# Altium schematic sheet REV1.SchDoc
size A4; SheetNumber: 2; SheetTotal: 3
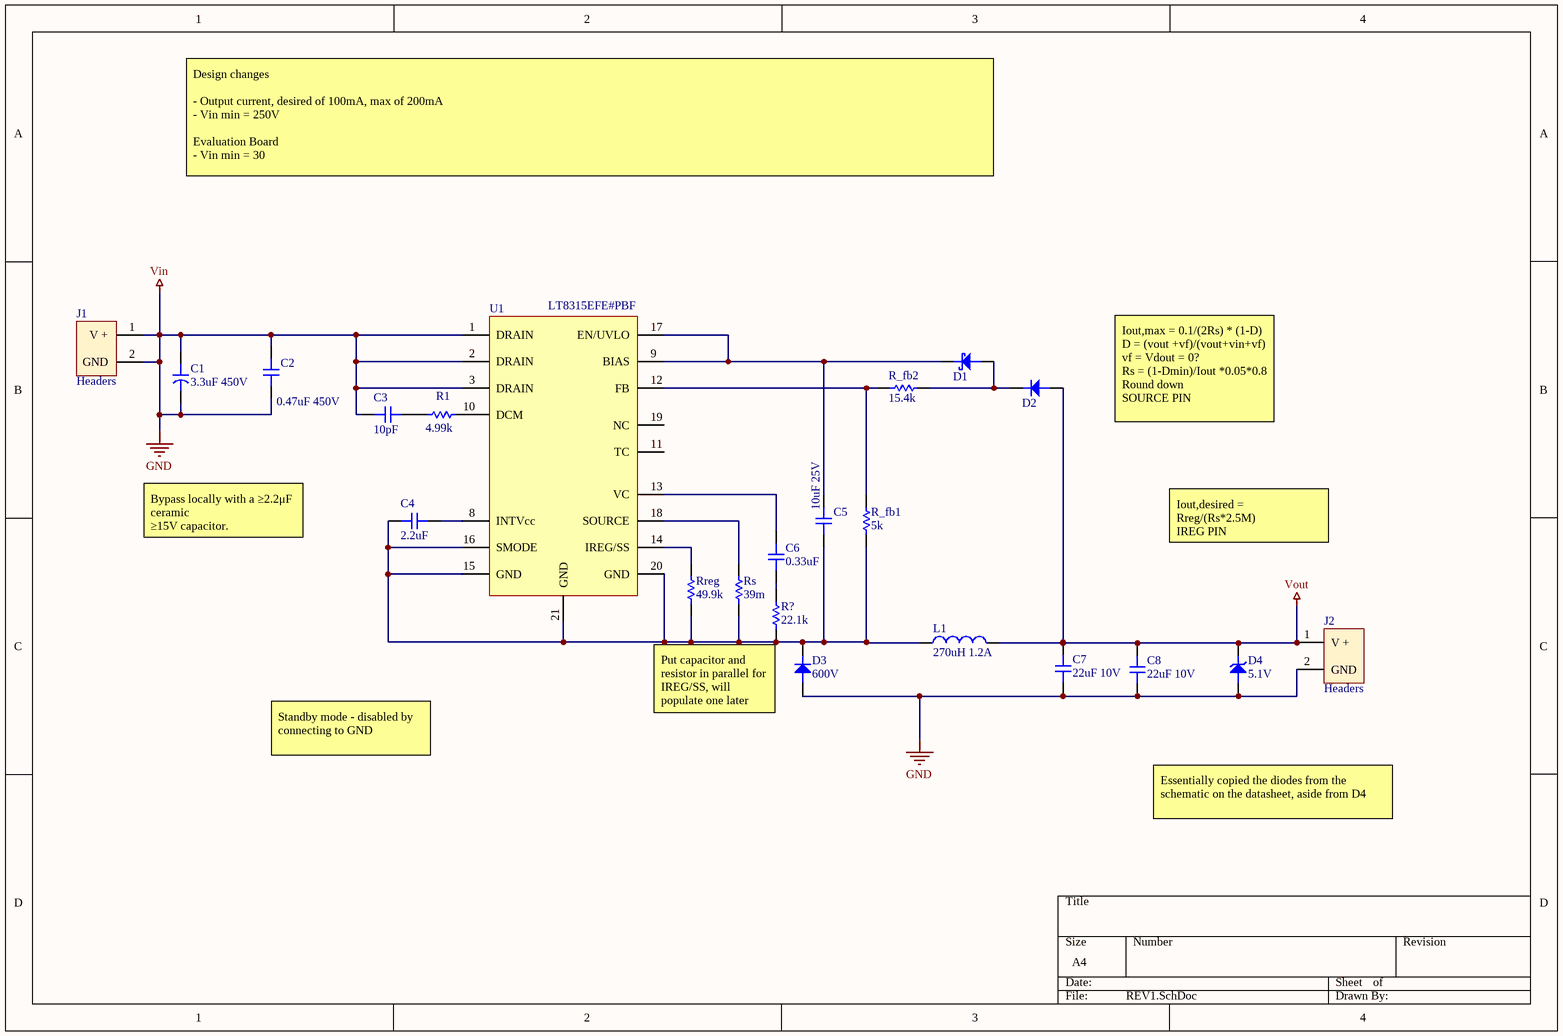
[diagram p0: REV1.SchDoc]

## Parts
C1  3.3uF 450V  [CAPAE125136X145M]
C2  0.47uF 450V  [CAPC4532X28N]
C3  10pF  [CAPC3216X09N]
C4  2.2uF  [CAPC1608X06N]
C5  10uF 25V  [CAPC3216X18N]
C6  0.33uF  [CAPC1608X09N]
C7  22uF 10V  [CAPC3225X28N]
C8  22uF 10V  [CAPC3225X28N]
D1  CMDSH2-3 TR PBFREE  (value not drawn)
D2  CMMR1U-06TRPBFREE  (value not drawn)
D3  600V
D4  5.1V  [SOT95P230X110-3N]
J1  Headers
J2  Headers
L1  270uH 1.2A
R1  4.99k  [4.99K]
R?  22.1k  [RESC2012X06N]
R_fb1  5k  [RESC0603X03N]
R_fb2  15.4k  [RESC1005X04N]
Rreg  49.9k  [RESC3115X07N]
Rs  39m
U1  LT8315EFE#PBF  [TSOP65P650X120-20N]

## Nets
GND: C1.1 C1.2 C2.1 C2.2 C3.1 C7.1 C8.1 D3.2 D4.2 J1.1(V_+) J1.2(GND) J2.2(GND) U1.1(DRAIN) U1.2(DRAIN) U1.3(DRAIN)  [also labelled Vin]
Vout: C7.2 C8.2 D2.2 D4.1 J2.1(V_+) L1.2
NetC3_2: C3.2 R1.1
NetC4_1: C4.1 C5.1 D3.1 L1.1 R?.1 R_fb1.1 Rreg.1 Rs.1 U1.15(GND) U1.16(SMODE) U1.20(GND) U1.21(GND)
NetC4_2: C4.2 U1.8(INTVcc)
NetC5_2: C5.2 D1.1 U1.9(BIAS) U1.17(EN/UVLO)
NetC6_1: C6.1 R?.2
NetC6_2: C6.2 U1.13(VC)
NetD1_2: D1.2 D2.1 R_fb2.2
NetR_fb1_2: R_fb1.2 R_fb2.1 U1.12(FB)
NetRreg_2: Rreg.2 U1.14(IREG/SS)
NetRs_2: Rs.2 U1.18(SOURCE)

Not connected (* = marked no-connect by the designer): R1 2; U1 10(DCM) 11(TC) 19(NC)

## Notes on the sheet
- Design changes
  - Output current, desired of 100mA, max of 200mA
  - Vin min = 250V
  Evaluation Board
  - Vin min = 30
- Iout,max = 0.1/(2Rs) * (1-D)
  D = (vout +vf)/(vout+vin+vf)
  vf = Vdout = 0?
  Rs = (1-Dmin)/Iout *0.05*0.8
  Round down
  SOURCE PIN
- Bypass locally with a ≥2.2μF ceramic
  ≥15V capacitor.
- Iout,desired = Rreg/(Rs*2.5M)
  IREG PIN
- Put capacitor and resistor in parallel for IREG/SS, will populate one later
- Standby mode - disabled by connecting to GND
- Essentially copied the diodes from the schematic on the datasheet, aside from D4

## Library data of the parts
C1 = UUJ2W3R3MNQ1MS: Al Cap UJ series SMT 3.3uF 450V; Manufacturer: Nichicon; Tolerance: 20%; Ripple Current: 40mA; Polarity: Polar; Leakage Current: 100uA; Life (Hours): 5000Hour; Lead Diameter: 1.4mm; Supplier 1: Digi-Key; Manufacturer Part Number: UUJ2W3R3MNQ1MS; RoHS: Yes; Category: Aluminum Electrolytic Capacitors; Stock 1: 1639; Pricing 1: 1=1.50000, 10=1.18700, 50=1.02860, 100=0.89010 (USD); Mount: Surface Mount; Case/Package: Radial; Min Operating Temperature: -40°C; Max Operating Temperature: 105°C; Capacitance: 3.3uF; Voltage Rating (DC): 450V; Packaging: Tape and Reel; Package Quantity: 500; Voltage Rating: 450V; Termination: SMD/SMT; Voltage: 450V; Series: UJ; Construction: Cylindrical; Diameter: 12.5mm; Length: 13.5mm; Height: 13.5mm; Lead Pitch: 4mm; Height - Seated (Max): 0.571inch; Radiation Hardening: No; RoHS Compliant: Yes; ComponentLink1URL: https://datasheet.ciiva.com/11781/0900766b80fa39e6-11781932.pdf?src-supplier=RSComponents; ComponentLink1Description: https://datasheet.ciiva.com/11781/0900766b80fa39e6-11781932.pdf?src-supplier=RSComponents; ComponentLink2URL: https://datasheet.ciiva.com/11687/e-uj-11687990.pdf?src-supplier=Avnet; ComponentLink2Description: https://datasheet.ciiva.com/11687/e-uj-11687990.pdf?src-supplier=Avnet; Supplier Part Number 1: 493-16089-1-ND
C2 = CGA8N4X7T2W474M230KA: Automotive Grade MLCC, 1812, X7T, 450V, 0.47 F, 20%, 2.30mm; Manufacturer: TDK; Capacitance: 470nF; Supplier 1: Digi-Key; Manufacturer Part Number: CGA8N4X7T2W474M230KA; RoHS: Yes; Category: Ceramic Capacitors; Stock 1: 1741; Pricing 1: 1=1.20000, 10=0.94400, 50=0.81800, 100=0.70780 (USD); Mount: Surface Mount; Case/Package: 1812; Case Code (Metric): 4532; Case Code (Imperial): 1812; Min Operating Temperature: -55°C; Max Operating Temperature: 125°C; Package Quantity: 500; Packaging: Tape and Reel; Tolerance: 20%; Voltage Rating: 450V; Series: CGA; Length: 0.177inch; Width: 0.126inch; Thickness: 0.098inch; Ratings: AEC-Q200; ComponentLink1URL: https://product.tdk.com/info/en/documents/chara_sheet/CGA8N4X7T2W474M230KA.pdf?src-supplier=Digi-Key; ComponentLink1Description: https://product.tdk.com/info/en/documents/chara_sheet/CGA8N4X7T2W474M230KA.pdf?src-supplier=Digi-Key; ComponentLink2URL: https://product.tdk.com/info/en/catalog/spec/mlccspec_automotive_general_midvoltage_en.pdf?src-supplier=Digi-Key; ComponentLink2Description: https://product.tdk.com/info/en/catalog/spec/mlccspec_automotive_general_midvoltage_en.pdf?src-supplier=Digi-Key; ComponentLink3URL: http://product.tdk.com/en/catalog/datasheets/mlcc_automotive_midvoltage_en.pdf?src-supplier=Avnet; ComponentLink3Description: http://product.tdk.com/en/catalog/datasheets/mlcc_automotive_midvoltage_en.pdf?src-supplier=Avnet; Supplier Part Number 1: 445-13132-1-ND
C3 = 885012008019: CAP CER 10PF 25V C0G/NP0 1206; Manufacturer: Wurth Electronics; Tolerance: 5%; Supplier 1: Digi-Key; Manufacturer Part Number: 885012008019; RoHS: Yes; Category: Ceramic Capacitors; Stock 1: 6290; Pricing 1: 1=0.11000, 10=0.09700, 100=0.08690, 500=0.07690 (USD); Mount: Surface Mount; Case/Package: 1206; Case Code (Metric): 3216; Case Code (Imperial): 1206; Min Operating Temperature: -55°C; Max Operating Temperature: 125°C; Packaging: Tape and Reel; Capacitance: 10pF; Voltage Rating: 25V; Length: 0.126inch; Width: 0.063inch; Thickness: 0.035inch; RoHS Compliant: Yes; ComponentLink1URL: http://www.farnell.com/datasheets/2546682.pdf?src-supplier=Farnell; ComponentLink1Description: http://www.farnell.com/datasheets/2546682.pdf?src-supplier=Farnell; ComponentLink2URL: http://katalog.we-online.de/pbs/datasheet/885012008019.pdf?src-supplier=Digi-Key; ComponentLink2Description: http://katalog.we-online.de/pbs/datasheet/885012008019.pdf?src-supplier=Digi-Key; ComponentLink3URL: https://katalog.we-online.de/pbs/datasheet/885012008019.pdf?src-supplier=Digi-Key; ComponentLink3Description: https://katalog.we-online.de/pbs/datasheet/885012008019.pdf?src-supplier=Digi-Key; Supplier Part Number 1: 732-7872-1-ND
C4 = EMK107BBJ225MK-T: CAP CER 2.2UF 16V X5R 0603; Manufacturer: Taiyo Yuden; Tolerance: 20%; Supplier 1: Digi-Key; Manufacturer Part Number: EMK107BBJ225MK-T; RoHS: Yes; Category: Ceramic Capacitors; Stock 1: 6186; Pricing 1: 1=0.27000, 10=0.18800, 50=0.12560, 100=0.10670, 500=0.07534, 1000=0.06593 (USD); Mount: Surface Mount; Case/Package: 0603; Min Operating Temperature: -55°C; Max Operating Temperature: 85°C; Packaging: Cut Tape; Capacitance: 2.2uF; Voltage Rating: 16V; RoHS Compliant: Yes; ComponentLink1URL: http://ds.yuden.co.jp/TYCOMPAS/ut/detail.do?productNo=EMK107BBJ225MK-T&fileName=EMK107BBJ225MK-T_SS&mode=specSheetDownload&src-supplier=Digi-Key; ComponentLink1Description: http://ds.yuden.co.jp/TYCOMPAS/ut/detail.do?productNo=EMK107BBJ225MK-T&fileName=EMK107BBJ225MK-T_SS&mode=specSheetDownload&src-supplier=Digi-Key; Supplier Part Number 1: 587-4866-1-ND
C5 = C3216X5R1E106M085AC: CAP CER 10UF 25V X5R 1206; Manufacturer: TDK; Dielectric Material: Ceramic; Tolerance: 20%; Supplier 1: Digi-Key; Manufacturer Part Number: C3216X5R1E106M085AC; RoHS: Yes; Category: Ceramic Capacitors; Stock 1: 61121; Pricing 1: 1=0.57000, 10=0.40100, 50=0.30300, 100=0.26390, 500=0.19550, 1000=0.16618 (USD); Mount: Surface Mount; Case/Package: 1206; Case Code (Metric): 3216; Case Code (Imperial): 1206; Weight: 0.000571oz; Min Operating Temperature: -55°C; Max Operating Temperature: 85°C; Package Quantity: 4000; Packaging: Tape and Reel; Capacitance: 10uF; Voltage Rating: 25V; Dielectric: X5R; Termination: SMD/SMT; Voltage Rating (DC): 25V; Series: C; Length: 0.126inch; Width: 0.063inch; Height: 0.85mm; Thickness: 0.039inch; Lead Free: Lead Free; ComponentLink1URL: https://datasheet.ciiva.com/14908/tdkmlcccaprange-14908421.pdf?src-supplier=Digi-Key; ComponentLink1Description: https://datasheet.ciiva.com/14908/tdkmlcccaprange-14908421.pdf?src-supplier=Digi-Key; ComponentLink2URL: https://datasheet.ciiva.com/14908/tdkmlcccaprange-14908422.pdf?src-supplier=Digi-Key; ComponentLink2Description: https://datasheet.ciiva.com/14908/tdkmlcccaprange-14908422.pdf?src-supplier=Digi-Key; Supplier Part Number 1: 445-14678-1-ND
C6 = 885012206023: CAP CER 0.33UF 10V X7R 0603; Manufacturer: Wurth Electronics; Capacitance: 330nF; Tolerance: 10%; Supplier 1: Digi-Key; Manufacturer Part Number: 885012206023; RoHS: Yes; Category: Ceramic Capacitors; Stock 1: 791; Pricing 1: 1=0.10000, 10=0.07800, 100=0.07020, 500=0.06210 (USD); Mount: Surface Mount; Case/Package: 0603; Case Code (Metric): 1608; Case Code (Imperial): 0603; Min Operating Temperature: -55°C; Max Operating Temperature: 125°C; Packaging: Cut Tape; Voltage Rating: 10V; Length: 0.063inch; Width: 0.031inch; Thickness: 0.037inch; RoHS Compliant: Yes; ComponentLink1URL: http://www.farnell.com/datasheets/2546810.pdf?src-supplier=Farnell; ComponentLink1Description: http://www.farnell.com/datasheets/2546810.pdf?src-supplier=Farnell; ComponentLink2URL: https://katalog.we-online.de/pbs/datasheet/885012206023.pdf?src-supplier=Digi-Key; ComponentLink2Description: https://katalog.we-online.de/pbs/datasheet/885012206023.pdf?src-supplier=Digi-Key; Supplier Part Number 1: 732-7942-1-ND
C7 C8 = C3225X5R1A226M230AA: CAP CER 22UF 10V X5R 1210; Manufacturer: TDK; Dielectric Material: Ceramic; Tolerance: 20%; Supplier 1: Digi-Key; Manufacturer Part Number: C3225X5R1A226M230AA; RoHS: Yes; Category: Ceramic Capacitors; Stock 1: 29265; Pricing 1: 1=0.59000, 10=0.41500, 50=0.31380, 100=0.27320, 500=0.20240 (USD); Mount: Surface Mount; Case/Package: 1210; Number of Pins: 2; Case Code (Metric): 3225; Case Code (Imperial): 1210; Weight: 0.000564oz; Min Operating Temperature: -55°C; Max Operating Temperature: 85°C; Capacitance: 22uF; Voltage Rating: 10V; Packaging: Tape and Reel; Package Quantity: 1; Voltage Rating (DC): 10V; Dielectric: X5R; Termination: SMD/SMT; Voltage: 10V; Series: C; Construction: Flat; Resistor Type: Ceramic; Length: 3.2mm; Width: 0.098inch; Height: 2.3mm; Depth: 2.5mm; Thickness: 0.098inch; REACH SVHC: No SVHC; Lead Free: Lead Free; ComponentLink1URL: https://datasheet.ciiva.com/11785/0900766b80c1bb00-11785903.pdf?src-supplier=RSComponents; ComponentLink1Description: https://datasheet.ciiva.com/11785/0900766b80c1bb00-11785903.pdf?src-supplier=RSComponents; ComponentLink2URL: https://datasheet.ciiva.com/6252/tdkmlcccaprange-6252831.pdf?src-supplier=Digi-Key; ComponentLink2Description: https://datasheet.ciiva.com/6252/tdkmlcccaprange-6252831.pdf?src-supplier=Digi-Key; ComponentLink3URL: https://datasheet.ciiva.com/6252/tdkmlcccaprange-6252837.pdf?src-supplier=Digi-Key; ComponentLink3Description: https://datasheet.ciiva.com/6252/tdkmlcccaprange-6252837.pdf?src-supplier=Digi-Key; ComponentLink4URL: https://datasheet.ciiva.com/16498/e412-c-16498766.pdf?src-supplier=Future+Electronics; ComponentLink4Description: https://datasheet.ciiva.com/16498/e412-c-16498766.pdf?src-supplier=Future+Electronics; ComponentLink5URL: https://datasheet.ciiva.com/28620/1571323-28620619.pdf?src-supplier=Element14; ComponentLink5Description: https://datasheet.ciiva.com/28620/1571323-28620619.pdf?src-supplier=Element14; ComponentLink6URL: https://datasheet.ciiva.com/22694/639999-22694174.pdf?src-supplier=Element14; ComponentLink6Description: https://datasheet.ciiva.com/22694/639999-22694174.pdf?src-supplier=Element14; Supplier Part Number 1: 445-1403-1-ND
D1 = CMDSH2-3 TR PBFREE: Silicon SCHOTTKY Diode High Current 30V 1A 2-Pin SOD-323 Surface Mount T/R; Manufacturer: Central Semiconductor; Supplier 1: Digi-Key; Manufacturer Part Number: CMDSH2-3 TR PBFREE; RoHS: Yes; Stock 1: 40881; Pricing 1: 1=0.65000, 10=0.57200, 100=0.43830, 500=0.34650, 1000=0.27720 (USD); RoHS Compliant: Yes; Supplier Part Number 1: 1514-CMDSH2-3TRPBFREECT-ND
D2 = CMMR1U-06TRPBFREE: Diode Switching 600V 1A Automotive 2-Pin SOD-123F T/R; Manufacturer: Central Semiconductor; Forward Voltage: 1.7V; Peak Non-Repetitive Surge Current: 30A; Element Configuration: Single; Supplier 1: Digi-Key; Manufacturer Part Number: CMMR1U-06TRPBFREE; RoHS: Yes; Category: Uncategorized; Stock 1: 10653; Pricing 1: 1=0.82000, 10=0.72600, 100=0.55660, 500=0.44000, 1000=0.35200 (USD); Mount: Surface Mount; Case/Package: SOD; Number of Pins: 2; Min Operating Temperature: -65°C; Max Operating Temperature: 150°C; Packaging: Tape and Reel; Radiation Hardening: No; RoHS Compliant: Yes; ComponentLink1URL: https://datasheet.ciiva.com/26939/getdatasheetpartid-707878-26939601.pdf?src-supplier=Verical; ComponentLink1Description: https://datasheet.ciiva.com/26939/getdatasheetpartid-707878-26939601.pdf?src-supplier=Verical; Supplier Part Number 1: 1514-CMMR1U-06TRPBFREECT-ND
D3 = HS2JFSM3G: https://www.mouser.ca/datasheet/2/395/HS2DFS_SERIES_B2004-1918239.pdf; Manufacturer: Taiwan Semiconductor; Supplier 1: DigiKey; Manufacturer Part Number: HS2JFSM3G; RoHS: No; Stock 1: 3460; Pricing 1: 1=0.45000, 10=0.38700, 100=0.28900, 500=0.22704, 1000=0.17544 (USD); Supplier Part Number 1: 1801-HS2JFSM3GCT-ND
D4 = BZX84-C5V1,215: Zener Diode Single 5.1V 5% 60Ohm 250mW Automotive 3-Pin SOT-23 T/R; Manufacturer: Nexperia; Supplier 1: Digi-Key; Manufacturer Part Number: BZX84-C5V1,215; RoHS: Yes; Stock 1: 23070; Pricing 1: 1=0.14000, 10=0.12900, 100=0.07000, 500=0.04308, 1000=0.02937 (USD); RoHS Compliant: Yes; ComponentLink1URL: http://www.farnell.com/datasheets/2242065.pdf?src-supplier=Farnell; ComponentLink1Description: http://www.farnell.com/datasheets/2242065.pdf?src-supplier=Farnell; ComponentLink2URL: https://assets.nexperia.com/documents/data-sheet/BZX84_SER.pdf?src-supplier=Digi-Key; ComponentLink2Description: https://assets.nexperia.com/documents/data-sheet/BZX84_SER.pdf?src-supplier=Digi-Key; Supplier Part Number 1: 1727-2939-1-ND
L1 = SDR1307-271KL: FIXED IND 270UH 1.2A 410 MOHM; Manufacturer: Bourns; Core Material: Ferrite; Saturation Current: 1.8A; Tolerance: 10%; Shielding: Unshielded; Self Resonant Frequency: 3.5MHz; Q Factor: 15; DC Resistance (DCR): 410mR; Test Frequency: 100kHz; Supplier 1: Digi-Key; Manufacturer Part Number: SDR1307-271KL; RoHS: Yes; Category: Fixed Inductors; Stock 1: 932; Pricing 1: 1=1.10000, 10=1.02200, 25=0.94400, 50=0.78640, 100=0.73930 (USD); Mount: Surface Mount; Case/Package: Nonstandard; Min Operating Temperature: -40°C; Max Operating Temperature: 125°C; Package Quantity: 400; Current Rating: 1.2A; Packaging: Tape and Reel; Inductance Tolerance: 10%; Inductance: 270uH; Resistor Type: Wirewound; Max DC Current: 1.2A; Termination: SMD/SMT; DC Current: 1.2A; RMS Current (Irms): 1.2A; Series: SDR1307; Diameter: 13mm; Length: 0.512inch; Width: 0.512inch; Height: 0.276inch; Height - Seated (Max): 0.288inch; Radiation Hardening: No; REACH SVHC: No SVHC; Military Standard: Not; ComponentLink1URL: https://datasheet.ciiva.com/1060/sdr1307-1060134.pdf?src-supplier=Digi-Key; ComponentLink1Description: https://datasheet.ciiva.com/1060/sdr1307-1060134.pdf?src-supplier=Digi-Key; ComponentLink2URL: https://datasheet.ciiva.com/1060/sdr1307-1060135.pdf?src-supplier=Digi-Key; ComponentLink2Description: https://datasheet.ciiva.com/1060/sdr1307-1060135.pdf?src-supplier=Digi-Key; ComponentLink3URL: https://datasheet.ciiva.com/8515/sdr1307-8515135.pdf?src-supplier=Avnet; ComponentLink3Description: https://datasheet.ciiva.com/8515/sdr1307-8515135.pdf?src-supplier=Avnet; ComponentLink4URL: https://datasheet.ciiva.com/6708/sdr1307-6708549.pdf?src-supplier=Digi-Key; ComponentLink4Description: https://datasheet.ciiva.com/6708/sdr1307-6708549.pdf?src-supplier=Digi-Key; ComponentLink5URL: https://datasheet.ciiva.com/22715/1723200-22715551.pdf?src-supplier=Element14; ComponentLink5Description: https://datasheet.ciiva.com/22715/1723200-22715551.pdf?src-supplier=Element14; ComponentLink6URL: https://datasheet.ciiva.com/30244/sdr1307-30244511.pdf?src-supplier=Onlinecomponents.com; ComponentLink6Description: https://datasheet.ciiva.com/30244/sdr1307-30244511.pdf?src-supplier=Onlinecomponents.com; Supplier Part Number 1: SDR1307-271KLCT-ND
R1 = CRCW12064K99FKEA: 4.99K DCM; Manufacturer: Vishay; Resistance: 4.99kR; Tolerance: 1%; Power Rating: 250mW; Temperature Coefficient: 100ppm/°C; Voltage Rating: 200V; Supplier 1: Digi-Key; Manufacturer Part Number: CRCW12064K99FKEA; RoHS: Yes; Category: Chip SMD Resistors; Stock 1: 47425; Pricing 1: 1=0.10000, 10=0.08200, 100=0.03160, 1000=0.01392, 2500=0.01202 (USD); Mount: Surface Mount; Case/Package: 1206; Contact Plating: Tin; Weight: 0.000353oz; Case Code (Metric): 3216; Case Code (Imperial): 1206; Size Code: 1206; Min Operating Temperature: -55°C; Max Operating Temperature: 155°C; Resistor Type: Thick Film; Packaging: Tape and Reel; Package Quantity: 10; Number of Terminations: 2; Termination: Solder; Max Power Dissipation: 250mW; Features: Automotive AEC-Q200; Series: CRCW; Voltage Rating (DC): 200V; Resistance Tolerance: 1%; Construction: Rectangular; Technology: THICK FILM; Length: 3.2mm; Width: 0.063inch; Height: 0.55mm; Depth: 1.6mm; Radiation Hardening: No; Lead Free: Lead Free; RoHS Compliant: Yes; REACH SVHC: Unknown; Military Standard: Not; ComponentLink1URL: https://datasheet.ciiva.com/2468/dcrcwe3-2468919.pdf?src-supplier=Digi-Key; ComponentLink1Description: https://datasheet.ciiva.com/2468/dcrcwe3-2468919.pdf?src-supplier=Digi-Key; ComponentLink2URL: https://datasheet.ciiva.com/2468/dcrcwe3-2468920.pdf?src-supplier=Digi-Key; ComponentLink2Description: https://datasheet.ciiva.com/2468/dcrcwe3-2468920.pdf?src-supplier=Digi-Key; ComponentLink3URL: https://datasheet.ciiva.com/2468/dcrcwe3-2468921.pdf?src-supplier=Digi-Key; ComponentLink3Description: https://datasheet.ciiva.com/2468/dcrcwe3-2468921.pdf?src-supplier=Digi-Key; ComponentLink4URL: https://datasheet.ciiva.com/5551/dcrcwe3-109170-5551479.pdf?src-supplier=Mouser; ComponentLink4Description: https://datasheet.ciiva.com/5551/dcrcwe3-109170-5551479.pdf?src-supplier=Mouser; ComponentLink5URL: https://datasheet.ciiva.com/9069/dcrcwe3-9069199.pdf?src-supplier=Avnet; ComponentLink5Description: https://datasheet.ciiva.com/9069/dcrcwe3-9069199.pdf?src-supplier=Avnet; ComponentLink6URL: https://datasheet.ciiva.com/16380/dcrcwe3-16380955.pdf?src-supplier=Future+Electronics; ComponentLink6Description: https://datasheet.ciiva.com/16380/dcrcwe3-16380955.pdf?src-supplier=Future+Electronics; ComponentLink7URL: https://datasheet.ciiva.com/16755/70201119-16755772.pdf?src-supplier=Allied+Electronics; ComponentLink7Description: https://datasheet.ciiva.com/16755/70201119-16755772.pdf?src-supplier=Allied+Electronics; ComponentLink8URL: https://datasheet.ciiva.com/16514/dcrcwe3-16514539.pdf?src-supplier=Avnet+Asia; ComponentLink8Description: https://datasheet.ciiva.com/16514/dcrcwe3-16514539.pdf?src-supplier=Avnet+Asia; Supplier Part Number 1: 541-4.99KFCT-ND
R? = RMCF0805FG22K1: Res Thick Film 0805 22.1K Ohm 1% 1/8W 100ppm/C Molded SMD SMD Paper T/R; Manufacturer: Stackpole Electronics; Resistance: 22.1kR; Max Power Dissipation: 125mW; Temperature Coefficient: 100ppm/°C; Supplier 1: Digi-Key; Manufacturer Part Number: RMCF0805FG22K1; RoHS: Yes; Category: Chip SMD Resistors; Stock 1: 16110; Pricing 1: 1=0.10000, 10=0.02700, 100=0.01090, 1000=0.00488, 2500=0.00423, 5000=0.00350 (USD); Mount: Surface Mount; Case/Package: 0805; Case Code (Metric): 2012; Case Code (Imperial): 0805; Contact Plating: Tin,Matte; Min Operating Temperature: -55°C; Max Operating Temperature: 155°C; Package Quantity: 10000; Packaging: Tape and Reel; Tolerance: 1%; Resistor Type: Thick Film; Number of Terminations: 2; Features: Automotive AEC-Q200; Series: RMCF; Length: 0.079inch; Width: 0.049inch; Height: 0.026inch; Radiation Hardening: No; Lead Free: Lead Free; RoHS Compliant: Yes; ComponentLink1URL: https://www.seielect.com/catalog/SEI-RMCF_RMCP.pdf?src-supplier=Avnet; ComponentLink1Description: https://www.seielect.com/catalog/SEI-RMCF_RMCP.pdf?src-supplier=Avnet; ComponentLink2URL: http://www.seielect.com/Catalog/SEI-RMCF_RMCP.pdf?src-supplier=Digi-Key; ComponentLink2Description: http://www.seielect.com/Catalog/SEI-RMCF_RMCP.pdf?src-supplier=Digi-Key; ComponentLink3URL: https://www.seielect.com/catalog/SEI-Packaging.pdf?src-supplier=Digi-Key; ComponentLink3Description: https://www.seielect.com/catalog/SEI-Packaging.pdf?src-supplier=Digi-Key; ComponentLink4URL: https://www.seielect.com/Catalog/SEI-RMCF_RMCP.pdf?src-supplier=Digi-Key; ComponentLink4Description: https://www.seielect.com/Catalog/SEI-RMCF_RMCP.pdf?src-supplier=Digi-Key; Supplier Part Number 1: RMCF0805FG22K1CT-ND
R_fb1 = TNPW02015K00BEED: Manufacturer: Vishay Dale; Supplier 1: Digi-Key; Manufacturer Part Number: TNPW02015K00BEED; RoHS: No; Stock 1: 3323; Pricing 1: 1=0.48000, 10=0.36500, 100=0.15350, 1000=0.08467, 2500=0.07938, 5000=0.07144 (USD); Supplier Part Number 1: 541-TNPW02015K00BEEDCT-ND
R_fb2 = ERJ-2RKF1542X: GLOVE, POLYAMIDE, L/FREE, PU, SIZE 6 - More Details; Manufacturer: Panasonic; Resistance: 15.4kR; Tolerance: 1%; Power Rating: 100mW; Voltage Rating: 50V; Temperature Coefficient: 100ppm/°C; Supplier 1: Digi-Key; Manufacturer Part Number: ERJ-2RKF1542X; RoHS: Yes; Category: Chip SMD Resistors; Stock 1: 11260; Pricing 1: 1=0.10000, 10=0.02500, 100=0.01020, 1000=0.00457, 2500=0.00397, 5000=0.00328 (USD); Mount: Surface Mount; Case/Package: 0402; Case Code (Imperial): 0402; Case Code (Metric): 1005; Contact Plating: Tin; Weight: 2.8E-05oz; Min Operating Temperature: -55°C; Max Operating Temperature: 155°C; Packaging: Tape and Reel; Package Quantity: 1; Resistor Type: Thick Film; Termination: SMD/SMT; Number of Terminations: 2; Max Power Dissipation: 100mW; Voltage Rating (DC): 50V; Features: Automotive AEC-Q200; Series: ERJ; Resistance Tolerance: 1%; Technology: THICK FILM; Construction: Rectangular; Length: 1mm; Width: 0.5mm; Height: 0.35mm; Depth: 0.5mm; Radiation Hardening: No; REACH SVHC: Yes; Military Standard: Not; RoHS Compliant: Yes; Lead Free: Lead Free; ComponentLink1URL: https://datasheet.ciiva.com/22774/1678782-22774075.pdf?src-supplier=Farnell; ComponentLink1Description: https://datasheet.ciiva.com/22774/1678782-22774075.pdf?src-supplier=Farnell; ComponentLink2URL: https://datasheet.ciiva.com/24163/aoa0000ce2-24163722.pdf?src-supplier=Mouser; ComponentLink2Description: https://datasheet.ciiva.com/24163/aoa0000ce2-24163722.pdf?src-supplier=Mouser; ComponentLink3URL: https://datasheet.ciiva.com/30091/aoa0000ce2-30091305.pdf?src-supplier=Onlinecomponents.com; ComponentLink3Description: https://datasheet.ciiva.com/30091/aoa0000ce2-30091305.pdf?src-supplier=Onlinecomponents.com; ComponentLink4URL: https://datasheet.ciiva.com/46436/1678782-46436982.pdf?src-supplier=Element14; ComponentLink4Description: https://datasheet.ciiva.com/46436/1678782-46436982.pdf?src-supplier=Element14; ComponentLink5URL: https://datasheet.ciiva.com/16760/70260748-16760316.pdf?src-supplier=Allied+Electronics; ComponentLink5Description: https://datasheet.ciiva.com/16760/70260748-16760316.pdf?src-supplier=Allied+Electronics; ComponentLink6URL: https://datasheet.ciiva.com/16761/70260748-16761511.pdf?src-supplier=Allied+Electronics; ComponentLink6Description: https://datasheet.ciiva.com/16761/70260748-16761511.pdf?src-supplier=Allied+Electronics; ComponentLink7URL: https://datasheet.ciiva.com/22681/1678782-22681271.pdf?src-supplier=Element14; ComponentLink7Description: https://datasheet.ciiva.com/22681/1678782-22681271.pdf?src-supplier=Element14; Supplier Part Number 1: P15.4KLCT-ND
Rreg = ERJ-8ENF4992V: RES SMD 49.9K OHM 1% 1/4W 1206; Manufacturer: Panasonic; Resistance: 49.9kR; Temperature Coefficient: 100ppm/°C; Voltage Rating: 200V; Power Rating: 250mW; Supplier 1: Digi-Key; Manufacturer Part Number: ERJ-8ENF4992V; RoHS: Yes; Category: Chip SMD Resistors; Stock 1: 75366; Pricing 1: 1=0.10000, 10=0.09300, 100=0.03560, 1000=0.01569, 2500=0.01355 (USD); Mount: Surface Mount; Case/Package: 1206; Contact Plating: Tin; Case Code (Metric): 3216; Case Code (Imperial): 1206; Min Operating Temperature: -55°C; Max Operating Temperature: 155°C; Tolerance: 1%; Resistor Type: Thick Film; Packaging: Tape and Reel; Package Quantity: 1; Number of Terminations: 2; Termination: SMD/SMT; Max Power Dissipation: 250mW; Voltage Rating (DC): 200V; Series: ERJ; Construction: Rectangular; Resistance Tolerance: 1%; Features: Automotive AEC-Q200; Length: 3.2mm; Width: 0.063inch; Height: 0.028inch; Depth: 1.6mm; Radiation Hardening: No; REACH SVHC: Unknown; Military Standard: Not; RoHS Compliant: Yes; Lead Free: Contains Lead; ComponentLink1URL: https://datasheet.ciiva.com/6064/426256-6064697.pdf?src-supplier=Farnell; ComponentLink1Description: https://datasheet.ciiva.com/6064/426256-6064697.pdf?src-supplier=Farnell; ComponentLink2URL: https://datasheet.ciiva.com/46377/426256-46377947.pdf?src-supplier=Element14; ComponentLink2Description: https://datasheet.ciiva.com/46377/426256-46377947.pdf?src-supplier=Element14; ComponentLink3URL: https://datasheet.ciiva.com/28548/1678782-28548377.pdf?src-supplier=Element14; ComponentLink3Description: https://datasheet.ciiva.com/28548/1678782-28548377.pdf?src-supplier=Element14; ComponentLink4URL: https://datasheet.ciiva.com/28694/1678782-28694249.pdf?src-supplier=Element14; ComponentLink4Description: https://datasheet.ciiva.com/28694/1678782-28694249.pdf?src-supplier=Element14; ComponentLink5URL: https://datasheet.ciiva.com/24026/aoa0000ce2-24026814.pdf?src-supplier=Mouser; ComponentLink5Description: https://datasheet.ciiva.com/24026/aoa0000ce2-24026814.pdf?src-supplier=Mouser; ComponentLink6URL: https://datasheet.ciiva.com/16772/70260748-16772229.pdf?src-supplier=Allied+Electronics; ComponentLink6Description: https://datasheet.ciiva.com/16772/70260748-16772229.pdf?src-supplier=Allied+Electronics; ComponentLink7URL: https://datasheet.ciiva.com/16724/70260748-16724652.pdf?src-supplier=Allied+Electronics; ComponentLink7Description: https://datasheet.ciiva.com/16724/70260748-16724652.pdf?src-supplier=Allied+Electronics; ComponentLink8URL: https://datasheet.ciiva.com/9189/aoa0000ce2-9189145.pdf?src-supplier=Avnet; ComponentLink8Description: https://datasheet.ciiva.com/9189/aoa0000ce2-9189145.pdf?src-supplier=Avnet; ComponentLink9URL: https://datasheet.ciiva.com/30219/aoa0000ce2-30219902.pdf?src-supplier=Onlinecomponents.com; ComponentLink9Description: https://datasheet.ciiva.com/30219/aoa0000ce2-30219902.pdf?src-supplier=Onlinecomponents.com; ComponentLink10URL: https://datasheet.ciiva.com/17209/aoa0000ce2-17209499.pdf?src-supplier=Avnet+Europe; ComponentLink10Description: https://datasheet.ciiva.com/17209/aoa0000ce2-17209499.pdf?src-supplier=Avnet+Europe; ComponentLink11URL: https://datasheet.ciiva.com/16513/aoa0000ce2-16513653.pdf?src-supplier=Avnet+Asia; ComponentLink11Description: https://datasheet.ciiva.com/16513/aoa0000ce2-16513653.pdf?src-supplier=Avnet+Asia; Supplier Part Number 1: P49.9KFCT-ND
Rs = ERJ-8CWJR039V: Res Thick Film 1206 0.039 Ohm 5% 1W 50ppm/C Molded SMD SMD Punched Carrier T/R; Manufacturer: Panasonic; Resistance: 39mR; Temperature Coefficient: 75ppm/°C; Supplier 1: Digi-Key; Manufacturer Part Number: ERJ-8CWJR039V; RoHS: Yes; Category: Chip SMD Resistors; Stock 1: 4176; Pricing 1: 1=0.54000, 10=0.41700, 100=0.17540, 1000=0.09678, 2500=0.09074 (USD); Mount: Surface Mount; Case/Package: 1206; Case Code (Metric): 3216; Case Code (Imperial): 1206; Min Operating Temperature: -55°C; Max Operating Temperature: 125°C; Packaging: Tape and Reel; Power Rating: 1W; Tolerance: 5%; Resistor Type: Thick Film; Number of Terminations: 2; Max Power Dissipation: 1W; Features: Automotive AEC-Q200; Length: 0.126inch; Width: 0.063inch; Height: 0.03inch; ComponentLink1URL: https://media.digikey.com/pdf/Data%20Sheets/Panasonic%20Resistors%20Thermistors%20PDFs/ERJ-8CW_Series_LE.pdf?src-supplier=Digi-Key; ComponentLink1Description: https://media.digikey.com/pdf/Data%20Sheets/Panasonic%20Resistors%20Thermistors%20PDFs/ERJ-8CW_Series_LE.pdf?src-supplier=Digi-Key; ComponentLink2URL: http://www.mouser.com/ds/2/315/AOA0000C295-1109214.pdf?src-supplier=Mouser; ComponentLink2Description: http://www.mouser.com/ds/2/315/AOA0000C295-1109214.pdf?src-supplier=Mouser; ComponentLink3URL: http://www.onlinecomponents.com/datasheet/erj-8cwjr039v.aspx?p=44454211&src-supplier=Onlinecomponents.com; ComponentLink3Description: http://www.onlinecomponents.com/datasheet/erj-8cwjr039v.aspx?p=44454211&src-supplier=Onlinecomponents.com; ComponentLink4URL: https://industrial.panasonic.com/cdbs/www-data/pdf/RDN0000/AOA0000C313.pdf?src-supplier=Digi-Key; ComponentLink4Description: https://industrial.panasonic.com/cdbs/www-data/pdf/RDN0000/AOA0000C313.pdf?src-supplier=Digi-Key; ComponentLink5URL: http://industrial.panasonic.com/www-data/pdf/AOA0000/AOA0000CE3.pdf?src-supplier=Avnet; ComponentLink5Description: http://industrial.panasonic.com/www-data/pdf/AOA0000/AOA0000CE3.pdf?src-supplier=Avnet; Supplier Part Number 1: P0.039BWCT-ND
U1 = LT8315EFE#PBF: IC REG CTRLR FLYBACK 20TSSOP; Manufacturer: Analog Devices / Linear Technology; Supplier 1: Digi-Key; Manufacturer Part Number: LT8315EFE#PBF; RoHS: Yes; Category: Voltage Regulators - Switching; Stock 1: 22; Pricing 1: 1=9.84000, 10=8.88800, 25=8.47480, 100=7.35850, 250=7.02780, 500=6.43500 (USD); RoHS Compliant: Yes; ComponentLink1URL: http://www.linear.com/docs/56703?src-supplier=Digi-Key; ComponentLink1Description: http://www.linear.com/docs/56703?src-supplier=Digi-Key; Supplier Part Number 1: LT8315EFE#PBF-ND